# Altium schematic sheet 05_Power.SchDoc
size A
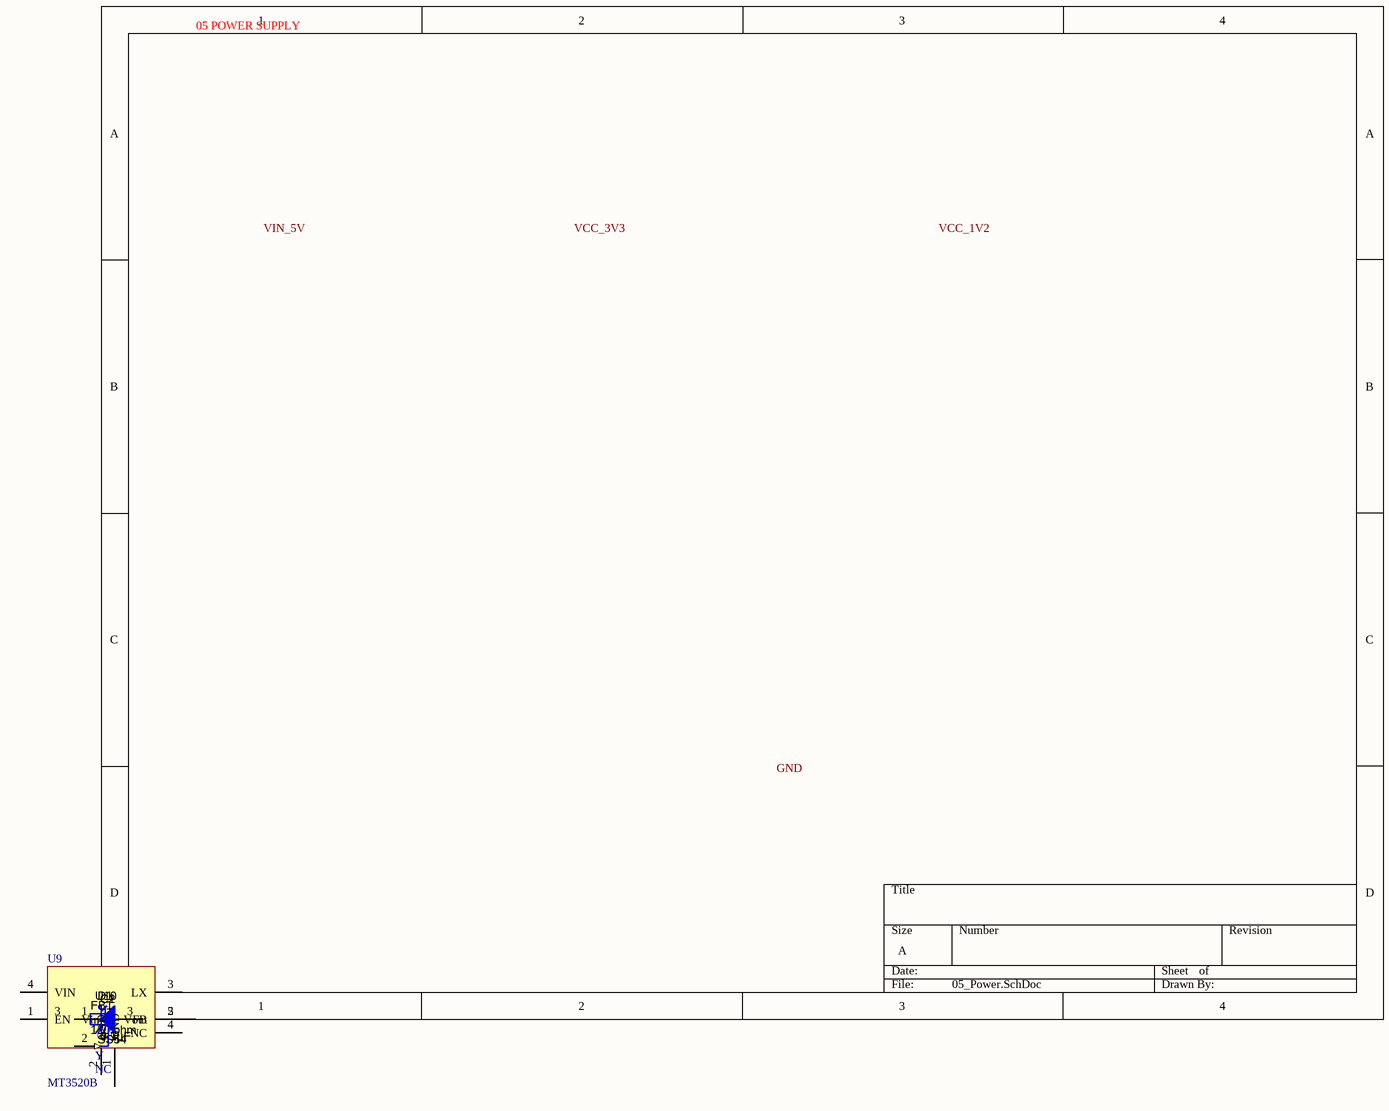
[diagram p0: 05_Power.SchDoc]

## Parts
C1  ValueDisplayed: 4.7µF  [0805_HV]  (hidden comment: GRM21BC81C475KA88L)
C2  ValueDisplayed: 0.1μF  [0402]  (hidden comment: C1005X7R1H104M)
D1  SS54  [SMB]
FB1  value 120 ohm  [0805_HV]  (hidden comment: GZ2012V121TF)
U8  LD1117-3.3  [SOT223-L]
U9  MT3520B  [DBV0005A_N]
U10  Parameter 1: NC  [DBZ0003A_N]  (hidden comment: Y)

## Nets
NetC1_1: C1.1 C2.1
NetC1_2: C1.2 C2.2 FB1.1
NetD1_1: D1.1(K) U10.1(CATHODE)
NetD1_2: D1.2(A) U10.3(ANODE)

Not connected (* = marked no-connect by the designer): FB1 2; U8 1(GND) 2(Vout) 3(Vin) 4(NC); U9 1(EN) 2(GND) 3(LX) 4(VIN) 5(FB); U10 2(REF)

## Notes on the sheet
- 05 POWER SUPPLY
- Labels drawn without touching a wire or pin: GND, VCC_1V2, VCC_3V3, VIN_5V

## Library data of the parts
C1 = GRM21BC81C475KA88L: CAP, CERM, 4.7 µF, 16 V, +/- 10%, X6S, 0805; Manufacturer: MuRata; Polarized: N; CompType: Capacitor; Value: 4.7uF; U/M: EA; Cap_F: 0.0000047; Tolerance_%: 10; Value1: Unknown; VDC_V: 16; Value2: 16V; TaMin_C: -55; TaMax_C: 105; Cap_Case: 0805; SymbolVersion: 2008-07-09; PartNumber: GRM21BC81C475KA88L; PackageReference: 0805; RoHS: Y; MountType: SMT; Technology: Ceramic; TempCo: X6S; Published: 2008-06-19; Publisher: Texas Instruments; LatestRevisionDate: 2015-05-02; ComponentLink1Description: Datasheet link; ComponentLink1URL: http://search.murata.co.jp/Ceramy/PnsearchViewAction.do?HnOFG=ON&HnNFG=ON&SEL_CNT=50&sLang=en&sKey=GRM21BC81C475KA88L&x=9&y=9&search=startwith; Supplier 1: Digi-Key; Supplier Part Number 1: GRM21BC81C475KA88L-ND; Supplier 2: Mouser; Supplier Part Number 2: 81-GRM21BC81C475KA8L; Supplier 3: Farnell; Supplier Part Number 3: 1889279
C2 = C1005X7R1H104M: CAP, CERM, 0.1 μF, 50 V, +/- 20%, X7R, 0402; Manufacturer: TDK; Polarized: N; CompType: Capacitor; Value: 0.1uF; U/M: EA; Cap_F: 0.0000001; Tolerance_%: 20; Value1: Unknown; VDC_V: 50; Value2: 50V; TaMin_C: -55; TaMax_C: 125; SymbolVersion: 2008-07-09; PartNumber: C1005X7R1H104M; PackageReference: 0402; RoHS: Y; MountType: SMT; Technology: Ceramic; TempCo: X7R; Cap_Case: 0402; Published: 2008-06-19; Publisher: Texas Instruments; LatestRevisionDate: 2015-05-02; ComponentLink1Description: Datasheet link; Supplier 1: Digi-Key; Supplier Part Number 1: 445-5933-1-ND; Supplier 2: Farnell; Supplier Part Number 2: 1907278
D1 = B340B-13-F: Diode, Schottky, 40 V, 3A, SMB; Manufacturer: Diodes Inc.; U/M: EA; Vf_V: 0.5; Value: 40V; Value2: 0.5V; Io_A: 3; Vr_V: 40; TJmax_C: 125; RJC_CperW: 25; CompType: Diode; SymbolVersion: 2008-12-08; PartNumber: SS54; PackageReference: SMB; Value1: 3A; MountType: SMT; Type: Schottky; RoHS: Y; Published: 2008-06-26; Publisher: Texas Instruments; LatestRevisionDate: 2015-04-30; ComponentLink1Description: Datasheet link; ComponentLink1URL: http://www.diodes.com/datasheets/ds30924.pdf; Supplier 1: Digi-Key; Supplier Part Number 1: B340B-FDICT-ND; Supplier 2: Mouser; Supplier Part Number 2: 621-B340B-F; Supplier 3: Farnell; Supplier Part Number 3: 1843677
FB1 = BLM21BD121SN1D: Ferrite Bead, 120 ohm @ 100 MHz, 0.2 A, 0805; Manufacturer: MuRata; Imax_A: 0.2; DCR_ohm: 0.25; Value1: 0.25 ohm; Value2: 0.2A; ZTyp@100MHz_Ohm: 120; CompType: Ferrite Bead; SymbolVersion: 2009-06-02; PartNumber: GZ2012V121TF; MountType: SMT; PackageReference: 0805; Published: 2014-04-30; Publisher: Texas Instruments; LatestRevisionDate: 2015-05-01; ComponentLink1Description: Datasheet link; ComponentLink1URL: http://search.murata.co.jp/Ceramy/image/img/PDF/ENG/L0110S0100BLM21B.pdf; RoHS: Y; Supplier 1: Digi-Key; Supplier Part Number 1: 490-1044-1-ND; Supplier 2: Mouser; Supplier Part Number 2: 81-BLM21BD121SN1D; Supplier 3: Farnell; Supplier Part Number 3: 1515637
U8 = AMS1117: LDO电源
U9 = RT8097: 1MHZ,2A,STEP-DOWM DC/DC; Partnumber: MT3520B
U10 = TL431AIDBZ: PRECISION PROGRAMMABLE REFERENCE, DBZ0003A; Manufacturer: Texas Instruments; SymbolCreator: a0412235; CompType: IC; U/M: EA; SymbolVersion: 2013-02-15; PartNumber: TL431AIDBZ; PackageReference: DBZ0003A; MountType: SMT; ComponentLink1Description: Datasheet Link; ComponentLink1URL: http://www.ti.com/lit/ds/symlink/tl431.pdf; RoHS: Y; Publisher: Texas Instruments; LatestRevisionDate: 2015-05-05; Alternate Manufacturer: Texas Instruments; IGNORE: Y